# Altium project poe.PrjPcb
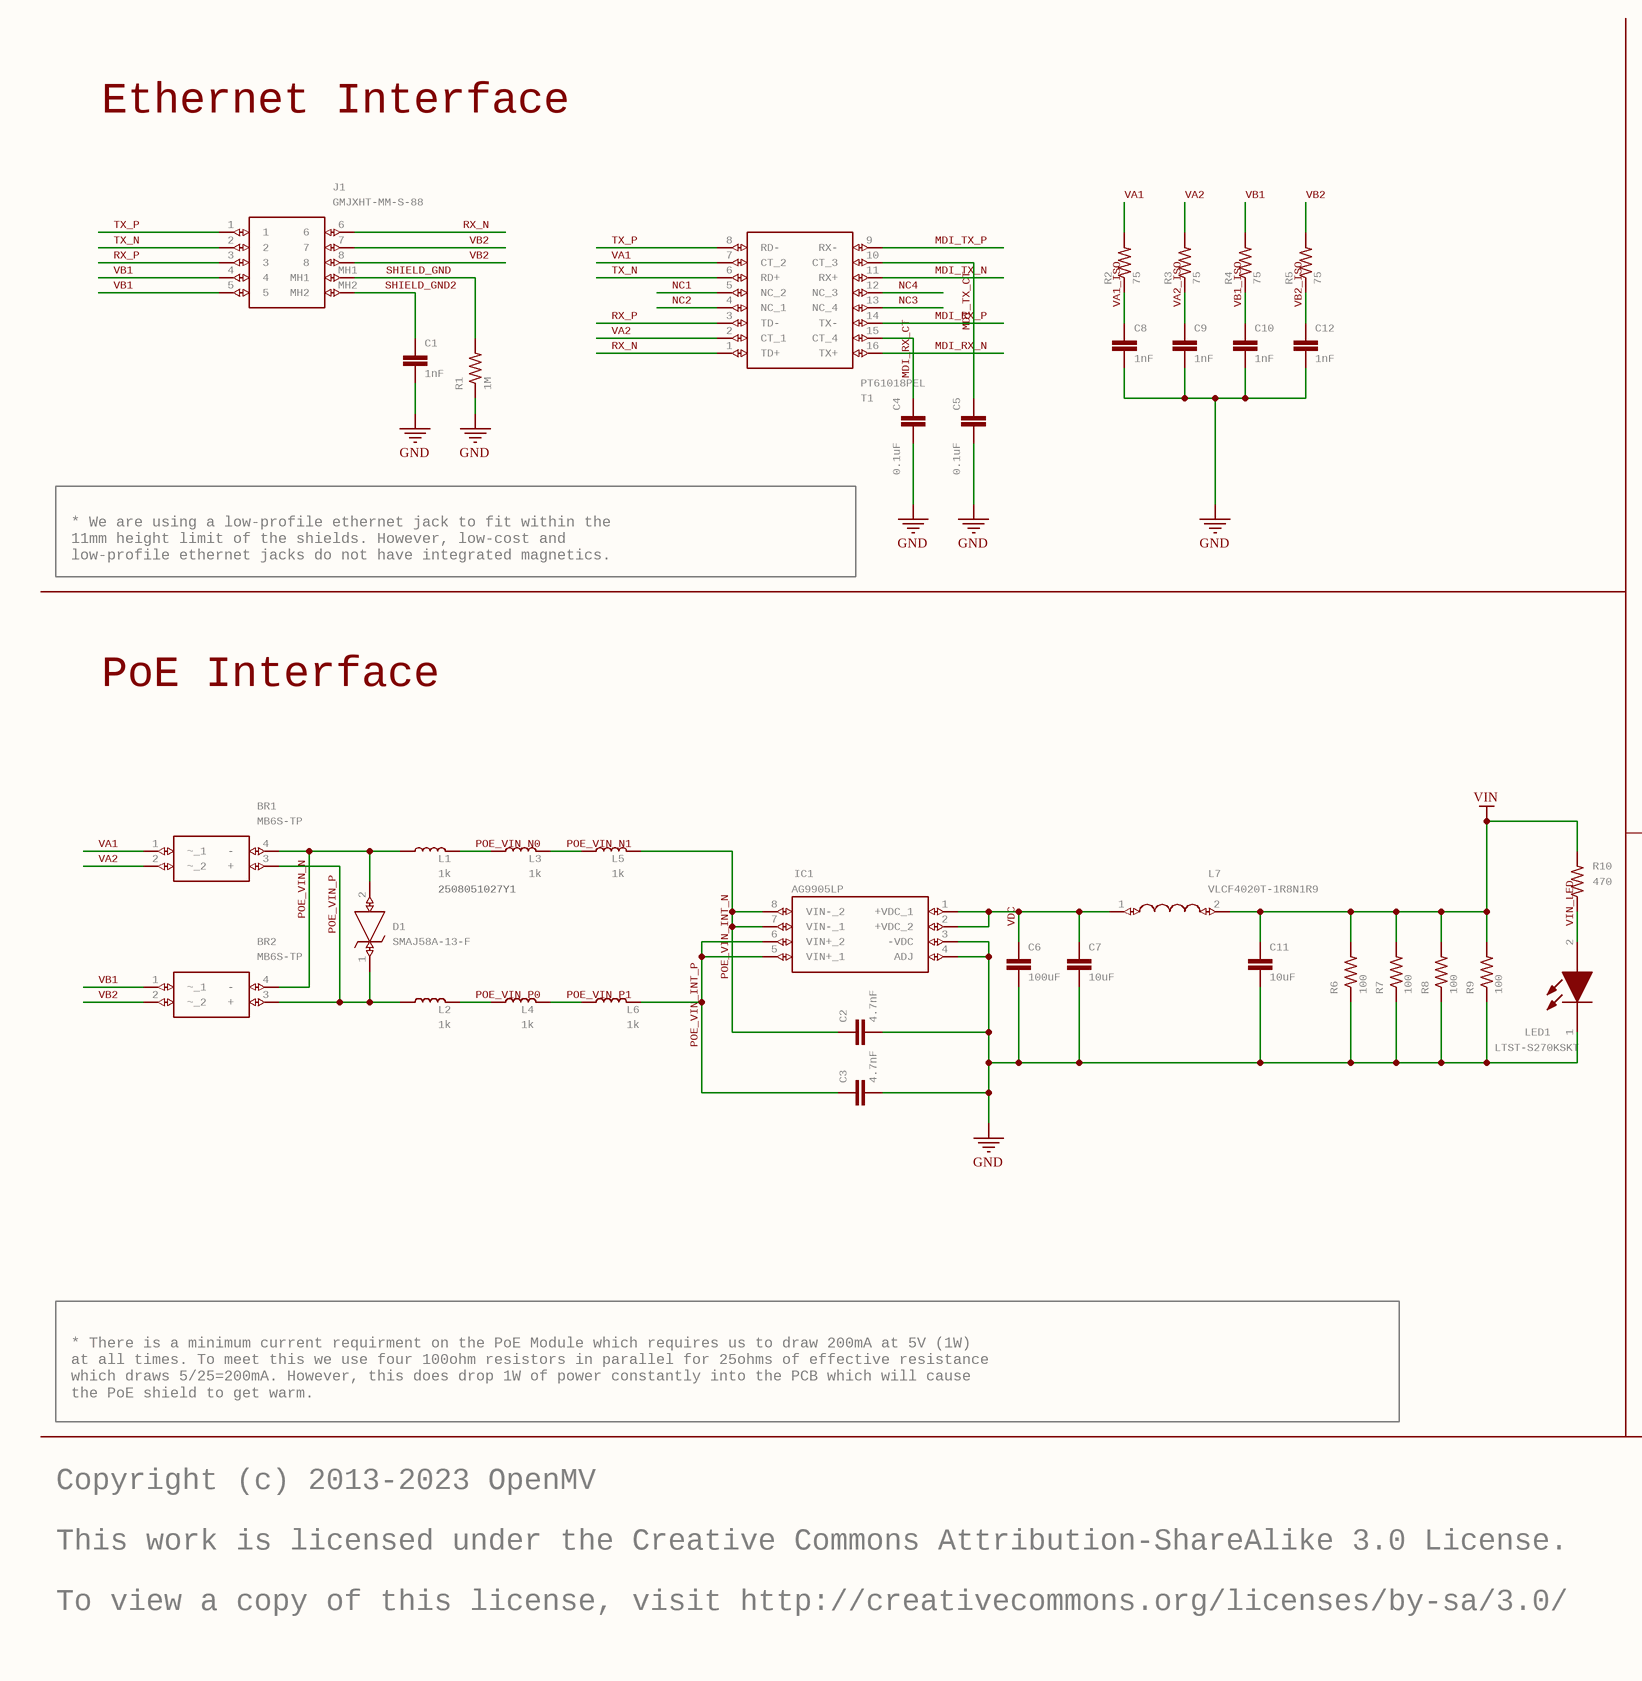
[diagram p0: poe.SchDoc, left]
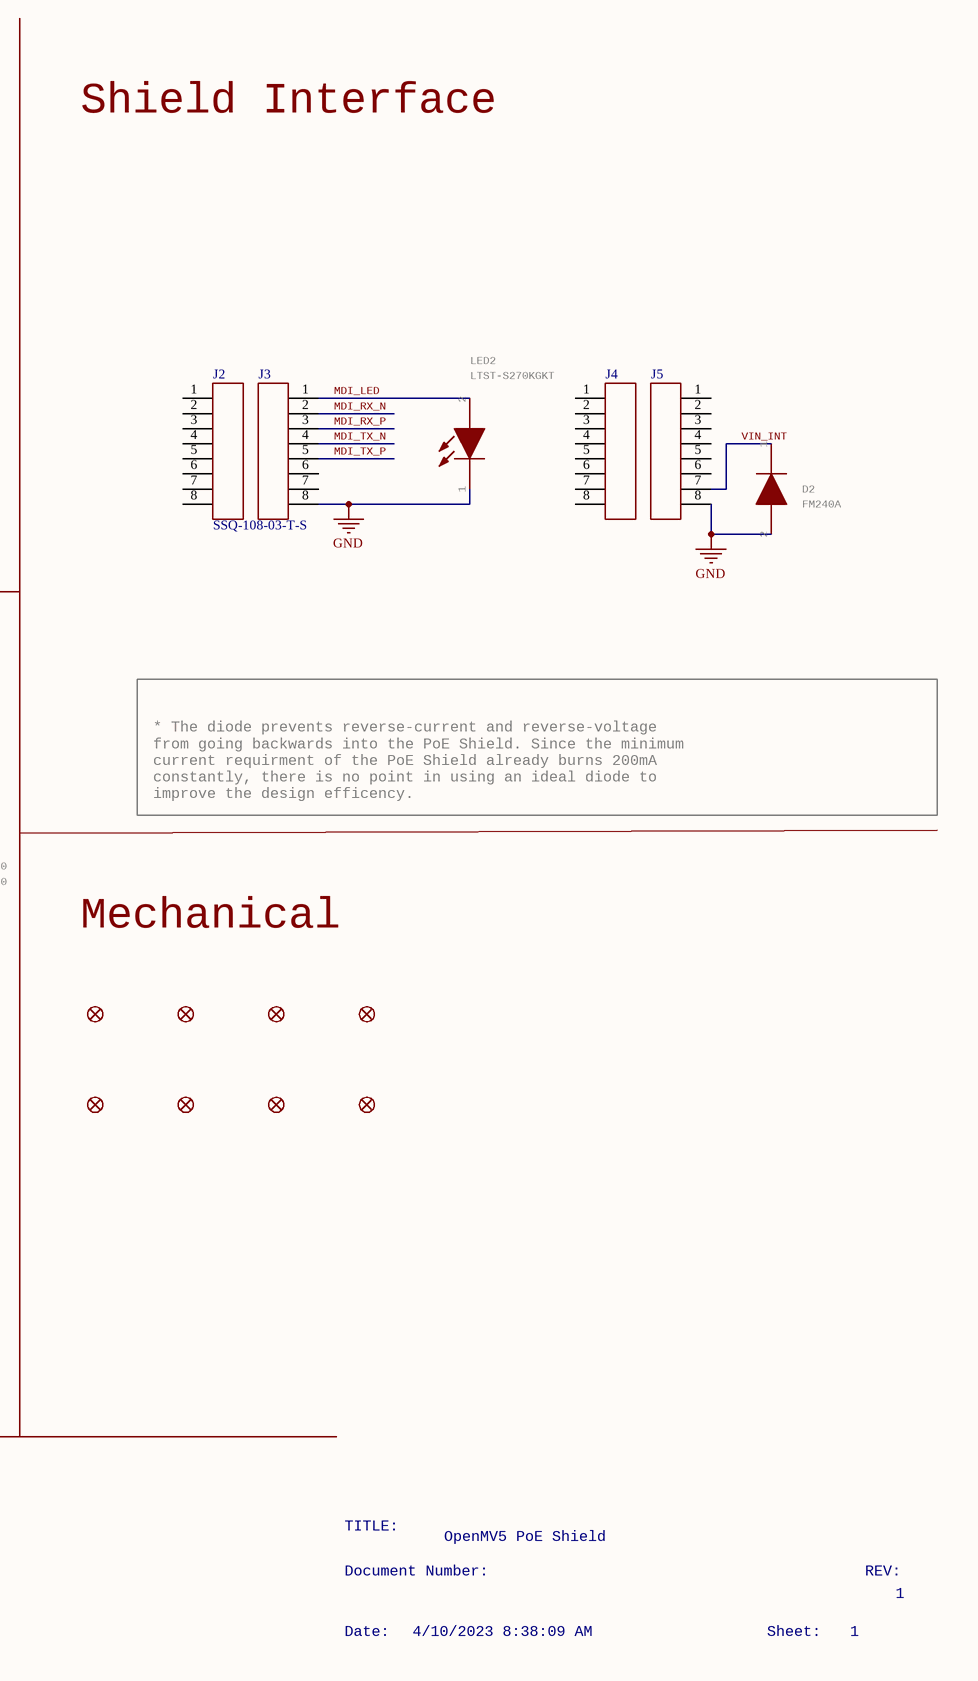
[diagram p1: poe.SchDoc, right]
1 sheet, 50 parts. Net scope: global (net labels, ports and power ports of the same name join across sheets).
Board file: poe.PcbDoc

## Sheet poe.SchDoc: poe
size 453 x 317 mm; Origin: Eagle; Date: 4/10/2023 8:38:09 AM; SheetNumber: 1; GateName_1: G$1; SymbolName_1: FRAME_B_L; LibraryName: frames; DeviceSetName: FRAME_B_L; GateName_2: G$2; SymbolName_2: DOCFIELD; Sheet: Sheet:; REV: REV:

### Parts
BR1  MB6S-TP  [SOP254P665X270-4N]
BR2  MB6S-TP  [SOP254P665X270-4N]
C1  1nF  [C1206]
C2  4.7nF  [C1812]
C3  4.7nF  [C1812]
C4  0.1uF  [C0402]
C5  0.1uF  [C0402]
C6  100uF  [C1206]
C7  10uF  [C0402]
C8  1nF  [C1206]
C9  1nF  [C1206]
C10  1nF  [C1206]
C11  10uF  [C0402]
C12  1nF  [C1206]
D1  SMAJ58A-13-F  [DIOM5226X230N]
D2  FM240A  [DIOM5025X231N]
FD1  FIDUCIAL1X2  [FIDUCIAL-1X2]  (value not drawn)  (no BOM)
FD2  FIDUCIAL1X2  [FIDUCIAL-1X2]  (value not drawn)  (no BOM)
FD3  FIDUCIAL1X2  [FIDUCIAL-1X2]  (value not drawn)  (no BOM)
FD4  FIDUCIAL1X2  [FIDUCIAL-1X2]  (value not drawn)  (no BOM)
FD5  FIDUCIAL1X2  [FIDUCIAL-1X2]  (value not drawn)  (no BOM)
FD6  FIDUCIAL1X2  [FIDUCIAL-1X2]  (value not drawn)  (no BOM)
FD7  FIDUCIAL1X2  [FIDUCIAL-1X2]  (value not drawn)  (no BOM)
FD8  FIDUCIAL1X2  [FIDUCIAL-1X2]  (value not drawn)  (no BOM)
IC1  AG9905LP  [AG9905LP]
J1  GMJXHT-MM-S-88  [GMJXHTMMS88]
J2  SSQ-108-03-T-S  [HDR_1X8]
J3  SSQ-108-03-T-S  [HDR_1X8]  (value not drawn)
J4  SSQ-108-03-T-S  [HDR_1X8]  (value not drawn)
J5  SSQ-108-03-T-S  [HDR_1X8]  (value not drawn)
L1  1k  Part Number: 2508051027Y1  [R0805]
L2  1k  [R0805]
L3  1k  [R0805]
L4  1k  [R0805]
L5  1k  [R0805]
L6  1k  [R0805]
L7  VLCF4020T-1R8N1R9  [VLCF4020T-1R8N1R9]
LED1  LTST-S270KSKT  [LTSTS270K]
LED2  LTST-S270KGKT  [LTSTS270K]
R1  1M  [R1206]
R2  75  [R0402]
R3  75  [R0402]
R4  75  [R0402]
R5  75  [R0402]
R6  100  [R2512]
R7  100  [R2512]
R8  100  [R2512]
R9  100  [R2512]
R10  470  [R0603]
T1  PT61018PEL  [SOIC127P930X565-16N]

### Nets
GND: C1.2 C2.2 C3.2 C4.2 C5.2 C6.2 C7.2 C8.2 C9.2 C10.2 C11.2 C12.2 D2.2(A) IC1.3(-VDC) IC1.4(ADJ) J3.8 J5.8 LED1.1(K) LED2.1(K) R1.1 R6.1 R7.1 R8.1 R9.1
VIN: C11.1 L7.2 R6.2 R7.2 R8.2 R9.2 R10.2
MDI_LED: J3.1 LED2.2(A)
MDI_RX_CT: C4.1 T1.15(CT_4)
MDI_RX_N: J3.2 T1.16(TX+)
MDI_RX_P: J3.3 T1.14(TX-)
MDI_TX_CT: C5.1 T1.10(CT_3)
MDI_TX_N: J3.4 T1.11(RX+)
MDI_TX_P: J3.5 T1.9(RX-)
NC1: T1.5(NC_2)
NC2: T1.4(NC_1)
NC3: T1.13(NC_4)
NC4: T1.12(NC_3)
POE_VIN_INT_N: C2.1 IC1.7(VIN-_1) IC1.8(VIN-_2) L5.2
POE_VIN_INT_P: C3.1 IC1.5(VIN+_1) IC1.6(VIN+_2) L6.2
POE_VIN_N: BR1.4(-) BR2.4(-) D1.2(A) L1.1
POE_VIN_N0: L1.2 L3.1
POE_VIN_N1: L3.2 L5.1
POE_VIN_P: BR1.3(+) BR2.3(+) D1.1(K) L2.1
POE_VIN_P0: L2.2 L4.1
POE_VIN_P1: L4.2 L6.1
RX_N: J1.6 T1.1(TD+)
RX_P: J1.3 T1.3(TD-)
SHIELD_GND: J1.MH1 R1.2
SHIELD_GND2: C1.1 J1.MH2
TX_N: J1.2 T1.6(RD+)
TX_P: J1.1 T1.8(RD-)
VA1: BR1.1(~_1) R2.2 T1.7(CT_2)
VA1_ISO: C8.1 R2.1
VA2: BR1.2(~_2) R3.2 T1.2(CT_1)
VA2_ISO: C9.1 R3.1
VB1: BR2.1(~_1) J1.4 J1.5 R4.2
VB1_ISO: C10.1 R4.1
VB2: BR2.2(~_2) J1.7 J1.8 R5.2
VB2_ISO: C12.1 R5.1
VDC: C6.1 C7.1 IC1.1(+VDC_1) IC1.2(+VDC_2) L7.1
VIN_INT: D2.1(K) J5.7
VIN_LED: LED1.2(A) R10.1

Not connected (* = marked no-connect by the designer): J2 1 2 3 4 5 6 7 8; J3 6 7; J4 1 2 3 4 5 6 7 8; J5 1 2 3 4 5 6

### Notes on the sheet
- Ethernet Interface
- Shield Interface
- * We are using a low-profile ethernet jack to fit within the
  11mm height limit of the shields. However, low-cost and
  low-profile ethernet jacks do not have integrated magnetics.
- PoE Interface
- * The diode prevents reverse-current and reverse-voltage
  from going backwards into the PoE Shield. Since the minimum
  current requirment of the PoE Shield already burns 200mA
  constantly, there is no point in using an ideal diode to
  improve the design efficency.
- Mechanical
- * There is a minimum current requirment on the PoE Module which requires us to draw 200mA at 5V (1W)
  at all times. To meet this we use four 100ohm resistors in parallel for 25ohms of effective resistance
  which draws 5/25=200mA. However, this does drop 1W of power constantly into the PCB which will cause
  the PoE shield to get warm.
- Copyright (c) 2013-2023 OpenMV
- TITLE:
- OpenMV5 PoE Shield
- This work is licensed under the Creative Commons Attribution-ShareAlike 3.0 License.
- To view a copy of this license, visit http://creativecommons.org/licenses/by-sa/3.0/
- Document Number:
- REV:
- 1
- Date:
- 4/10/2023 8:38:09 AM
- Sheet:

### Library data of the parts
BR1 BR2 = MB6S-TP: MICRO COMMERCIAL COMPONENTS - MB6S-TP - BRIDGE RECTIFIER, 500mA, 600V   Source:  Datasheet; MANUFACTURER_NAME: MCC; GateName_1: G$1; SymbolName_1: MB6S-TP; LibraryName: MB6S-TP; DeviceSetName: MB6S-TP; HEIGHT: 2.7mm; MANUFACTURER_PART_NUMBER: MB6S-TP; MOUSER_PART_NUMBER: 833-MB6S-TP; MOUSER_PRICE-STOCK: https://www.mouser.co.uk/ProductDetail/Micro-Commercial-Components-MCC/MB6S-TP?qs=O2qRfqcg9D9hSJLw3ZCqJw%3D%3D; MPN: MB6S-TP; Part Number: MB6S-TP
C1 C8-C10 C12 = C-EUC1206: CAPACITOR, European symbol; MPN: 1206B102K252CT; GateName_1: G$1; SymbolName_1: C-EU; POPULARITY: 54; DeviceName: C1206; LibraryName: rcl; DeviceSetName: C-EU; SPICEPREFIX: C; Part Number: 1206B102K252CT
C2 C3 = C-EUC1812: CAPACITOR, European symbol; MPN: 202S43W472KV4E; GateName_1: G$1; SymbolName_1: C-EU; POPULARITY: 3; DeviceName: C1812; LibraryName: rcl; DeviceSetName: C-EU; SPICEPREFIX: C; Part Number: 202S43W472KV4E
C4 C5 = C-EUC0201: CAPACITOR, European symbol; MPN: GRM155R71H104KE14D; GateName_1: G$1; SymbolName_1: C-EU; DeviceName: C0201; POPULARITY: 0; LibraryName: rcl; DeviceSetName: C-EU; SPICEPREFIX: C; Part Number: GRM155R71H104KE14D
C6 = C-EUC1206: CAPACITOR, European symbol; MPN: CL31A107MQHNNWE; GateName_1: G$1; SymbolName_1: C-EU; POPULARITY: 54; DeviceName: C1206; LibraryName: rcl; DeviceSetName: C-EU; SPICEPREFIX: C; Part Number: CL31A107MQHNNWE
C7 C11 = C-EUC0402: CAPACITOR, European symbol; MPN: GRM155R60J106ME05D; GateName_1: G$1; SymbolName_1: C-EU; POPULARITY: 18; DeviceName: C0402; LibraryName: rcl; DeviceSetName: C-EU; SPICEPREFIX: C; Part Number: GRM155R60J106ME05D
D1 = SMAJ58A-13-F: Diodes Inc SMAJ58A-13-F, Uni-Directional TVS Diode, 400W, 2-Pin DO-214AC   Source:  Datasheet; MANUFACTURER_NAME: Diodes Inc.; MPN: SMAJ58A/TR13; GateName_1: G$1; SymbolName_1: SMAJ58A-13-F; LibraryName: SMAJ58A-13-F; DeviceSetName: SMAJ58A-13-F; HEIGHT: 2.3mm; MANUFACTURER_PART_NUMBER: SMAJ58A-13-F; MOUSER_PART_NUMBER: 621-SMAJ58A-13-F; MOUSER_PRICE-STOCK: https://www.mouser.co.uk/ProductDetail/Diodes-Incorporated/SMAJ58A-13-F?qs=gaDBXWSqsDABoBswSRRvMQ%3D%3D; Part Number: SMAJ58A/TR13
D2 = FM240A: Diodes - General Purpose, Power, Switching GP Si Rectifier SMB,2A,40V   Source:  Datasheet; MANUFACTURER_NAME: Rectron; GateName_1: G$1; SymbolName_1: FM240A; LibraryName: FM240A; DeviceSetName: FM240A; HEIGHT: 2.31mm; MANUFACTURER_PART_NUMBER: FM240A; MOUSER_PART_NUMBER: 583-FM240A; MOUSER_PRICE-STOCK: https://www.mouser.co.uk/ProductDetail/Rectron/FM240A?qs=7pEAo90IqNG7sknZwmLYhQ%3D%3D; MPN: FM240A; Part Number: FM240A
FD1-FD8 = FIDUCIAL1X2: Fiducial Alignment Points    Point-of-reference for pick-and-place machines and other optical instruments.; GateName_1: G$1; DeviceName: 1X2; SymbolName_1: FIDUCIAL; LibraryName: SparkFun-Aesthetics; DeviceSetName: FIDUCIAL
IC1 = AG9905LP: Power Management Modules IEEE802.3af PD module. 5V 7W, low profile   Source:  Datasheet; MANUFACTURER_NAME: Silvertel; GateName_1: G$1; SymbolName_1: AG9905LP; LibraryName: Ag9905LP; DeviceSetName: AG9905LP; HEIGHT: 8.5mm; MANUFACTURER_PART_NUMBER: Ag9905LP; MOUSER_PART_NUMBER: 480-AG9905LP; MOUSER_PRICE-STOCK: https://www.mouser.co.uk/ProductDetail/Silvertel/Ag9905LP?qs=OlC7AqGiEDm9ZoM6zJQCoQ%3D%3D; MPN: Ag9905LP; Part Number: Ag9905LP
J1 = GMJXHT-MM-S-88: MODJACK MIDMOUNT 8P8C SHIELD RoHS COMPLIANT   Source:  Datasheet; MANUFACTURER_NAME: Kycon; GateName_1: G$1; SymbolName_1: GMJXHT-MM-S-88; LibraryName: GMJXHT-MM-S-88; DeviceSetName: GMJXHT-MM-S-88; HEIGHT: 10.1mm; MANUFACTURER_PART_NUMBER: GMJXHT-MM-S-88; MOUSER_PART_NUMBER: 806-GMJXHT-MM-S-88; MOUSER_PRICE-STOCK: https://www.mouser.co.uk/ProductDetail/Kycon/GMJXHT-MM-S-88?qs=2OnyuXx6vpiODS6CjVUhnA%3D%3D; MPN: GMJXHT-MM-S-88; Part Number: GMJXHT-MM-S-88
J2-J5 = HDR_1X8: MANUFACTURER P/N: SSQ-108-03-T-S
L1 = INDUCTOR-0402-3.9NH: Inductors    Resist changes in electrical current. Basically a coil of wire.   SparkFun Products:  SparkFun Load Cell Amplifier - HX711  IOIO-OTG - V2.2; GateName_1: G$1; PROD_ID: NDUC-13457; SymbolName_1: INDUCTOR; DeviceName: -0402-3.9NH; LibraryName: SparkFun-Coils; DeviceSetName: INDUCTOR; MPN: 2508051027Y1
L2-L6 = INDUCTOR-0402-3.9NH: Inductors    Resist changes in electrical current. Basically a coil of wire.   SparkFun Products:  SparkFun Load Cell Amplifier - HX711  IOIO-OTG - V2.2; MPN: 2508051027Y1; GateName_1: G$1; PROD_ID: NDUC-13457; SymbolName_1: INDUCTOR; DeviceName: -0402-3.9NH; LibraryName: SparkFun-Coils; DeviceSetName: INDUCTOR; Part Number: 2508051027Y1
L7 = NR6045T1R8N: Power Inductors - SMD 1.8uH 1.9A 4x4x2.0mm; MANUFACTURER_NAME: TDK; GateName_1: G$1; MANUFACTURER_PART_NUMBER: VLCF4020T-1R8N1R9; MPN: VLCF4020T-1R8N1R9; Part Number: VLCF4020T-1R8N1R9
LED1 = LTST-S270KSKT: LED,0603,Side View,Yellow,60mcd Lite-On LTST-S270KSKT Yellow LED, 589 nm 1608 (0603) Side View, Rectangle Lens SMD package   Source:  Datasheet; GateName_1: G$1; SymbolName_1: LTST-S270K; LibraryName: LTST-S270K; DeviceSetName: LTST-S270KSKT; HEIGHT: 1mm; MANUFACTURER_NAME: Lite-On; MANUFACTURER_PART_NUMBER: LTST-S270KSKT; MOUSER_PART_NUMBER: 859-LTST-S270KSKT; MOUSER_PRICE-STOCK: https://www.mouser.com/ProductDetail/Lite-On/LTST-S270KSKT?qs=1%252Ba%252Bh4jXs3oCxYgJuiLmrQ%3D%3D; MPN: LTST-S270KSKT; Part Number: LTST-S270KSKT
LED2 = LTST-S270KGKT: LED,0603,Side View,Green,35mcd Lite-On LTST-S270KGKT Green LED,571 nm 1608 (0603) Side View, Rectangle Lens SMD package   Source:  Datasheet; GateName_1: G$1; SymbolName_1: LTST-S270K; LibraryName: LTST-S270K; DeviceSetName: LTST-S270KGKT; HEIGHT: 1mm; MANUFACTURER_NAME: Lite-On; MANUFACTURER_PART_NUMBER: LTST-S270KGKT; MOUSER_PART_NUMBER: 859-LTST-S270KGKT; MOUSER_PRICE-STOCK: https://www.mouser.com/ProductDetail/Lite-On/LTST-S270KGKT?qs=oL5uk4n%2FG821%2FMiCU6RADg%3D%3D; MPN: LTST-S270KGKT; Part Number: LTST-S270KGKT
R1 = R-US_R1206: RESISTOR, American symbol; MPN: RMCF1206FT1M00; GateName_1: G$1; SymbolName_1: R-US; DeviceSetName: R-US_; POPULARITY: 19; DeviceName: R1206; LibraryName: rcl; SPICEPREFIX: R; Part Number: RMCF1206FT1M00
R2-R5 = R-US_R0402: RESISTOR, American symbol; MPN: CR0402-FX-75R0GLF; GateName_1: G$1; SymbolName_1: R-US; DeviceSetName: R-US_; POPULARITY: 34; DeviceName: R0402; LibraryName: rcl; SPICEPREFIX: R; Part Number: CR0402-FX-75R0GLF
R6-R9 = R-US_R2512: RESISTOR, American symbol; MPN: RC2512JK-07100RL; GateName_1: G$1; SymbolName_1: R-US; DeviceSetName: R-US_; POPULARITY: 0; DeviceName: R2512; LibraryName: rcl; SPICEPREFIX: R; Part Number: RC2512JK-07100RL
R10 = R-US_R0603: RESISTOR, American symbol; MPN: CR0603-FX-4700ELF; GateName_1: G$1; SymbolName_1: R-US; DeviceSetName: R-US_; POPULARITY: 77; DeviceName: R0603; LibraryName: rcl; SPICEPREFIX: R; Part Number: CR0603-FX-4700ELF
T1 = PT61018PEL: BOURNS - PT61018PEL - TRANSFORMER, LAN, 1CT:1CT, 350UH, SMD   Source:  Datasheet; GateName_1: G$1; SymbolName_1: PT61018PEL; LibraryName: PT61018PEL; DeviceSetName: PT61018PEL; HEIGHT: 5.65mm; MANUFACTURER_NAME: Bourns; MANUFACTURER_PART_NUMBER: PT61018PEL; MOUSER_PART_NUMBER: 652-PT61018PEL; MOUSER_PRICE-STOCK: https://www.mouser.co.uk/ProductDetail/Bourns/PT61018PEL?qs=G1LhLIAbs1x4VqIQtFg%252BEw%3D%3D; MPN: PT61018PEL; Part Number: PT61018PEL